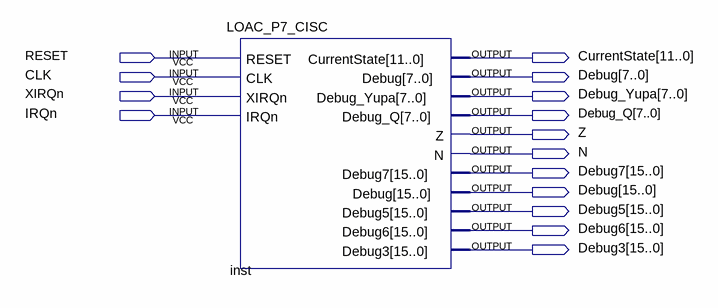
[diagram p0: schematic sheet]
// Quartus schematic Block1.bdf as structural Verilog: 1 symbols, 15 pins
module Block1 (
  input  RESET,
  input  CLK,
  input  XIRQn,
  input  IRQn,
  output [11:0] CurrentState,
  output [15:0] Debug,
  output [7:0] Debug_Yupa,
  output [7:0] Debug_Q,
  output Z,
  output N,
  output [15:0] Debug7,
  output [15:0] Debug5,
  output [15:0] Debug6,
  output [15:0] Debug3
);

  LOAC_P7_CISC inst (
    .RESET(RESET), .CLK(CLK), .XIRQn(XIRQn), .IRQn(IRQn), .CurrentState(CurrentState),
    .Debug({Debug[15:7], Debug[7:6], Debug[6:5], Debug[5:4], Debug[4:3], Debug[3:2], Debug[2:1], Debug[1:0], Debug[0]}),
    .Debug_Yupa(Debug_Yupa), .Debug_Q(Debug_Q), .Z(Z), .N(N), .Debug7(Debug7), .Debug5(Debug5),
    .Debug6(Debug6), .Debug3(Debug3));
endmodule
